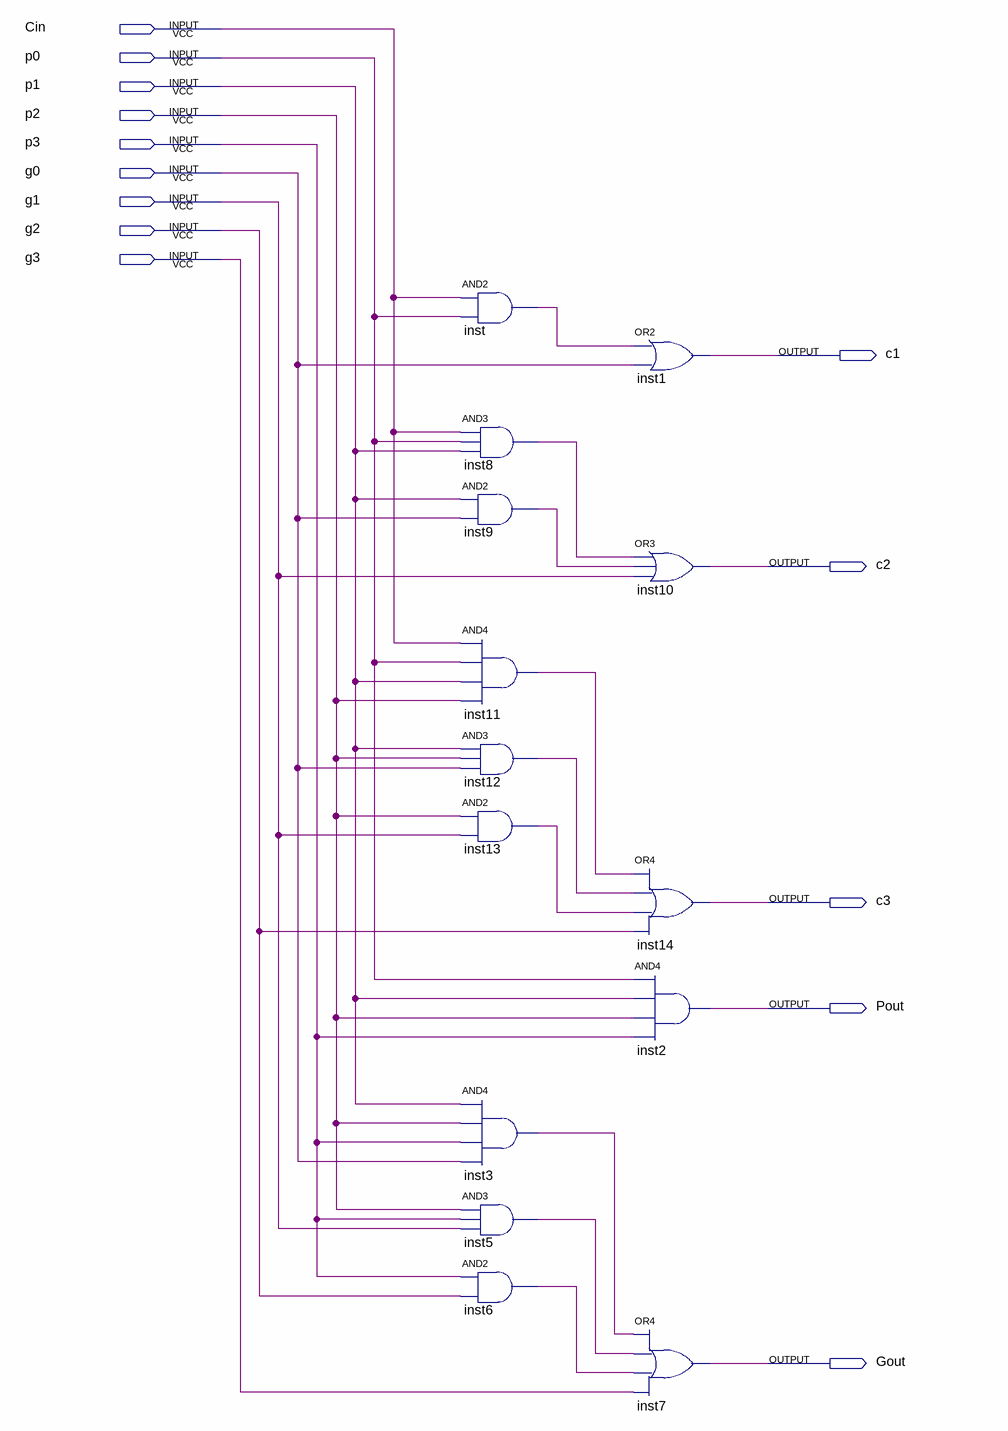
[diagram p0: schematic sheet]
// Quartus schematic add4pg_carrygenerator.bdf as structural Verilog: 14 symbols, 14 pins
module add4pg_carrygenerator (
  input  Cin,
  input  p0,
  input  p1,
  input  p2,
  input  p3,
  input  g0,
  input  g1,
  input  g2,
  input  g3,
  output c1,
  output c2,
  output c3,
  output Pout,
  output Gout
);

  wire inst3_out, inst5_out, inst6_out, inst8_out, inst9_out, inst11_out, inst12_out, inst13_out, inst_out;

  and inst (inst_out, Cin, p0);
  and inst8 (inst8_out, Cin, p0, p1);
  and inst9 (inst9_out, p1, g0);
  and inst11 (inst11_out, Cin, p0, p1, p2);
  and inst12 (inst12_out, p1, p2, g0);
  and inst13 (inst13_out, p2, g1);
  and inst3 (inst3_out, p1, p2, p3, g0);
  and inst5 (inst5_out, p2, p3, g1);
  and inst6 (inst6_out, p3, g2);
  or inst1 (c1, inst_out, g0);
  or inst10 (c2, inst8_out, inst9_out, g1);
  or inst14 (c3, inst11_out, inst12_out, inst13_out, g2);
  and inst2 (Pout, p0, p1, p2, p3);
  or inst7 (Gout, inst3_out, inst5_out, inst6_out, g3);
endmodule
